# EAGLE design BPW5031 Arcade MegaWing (EAGLE 5.11)
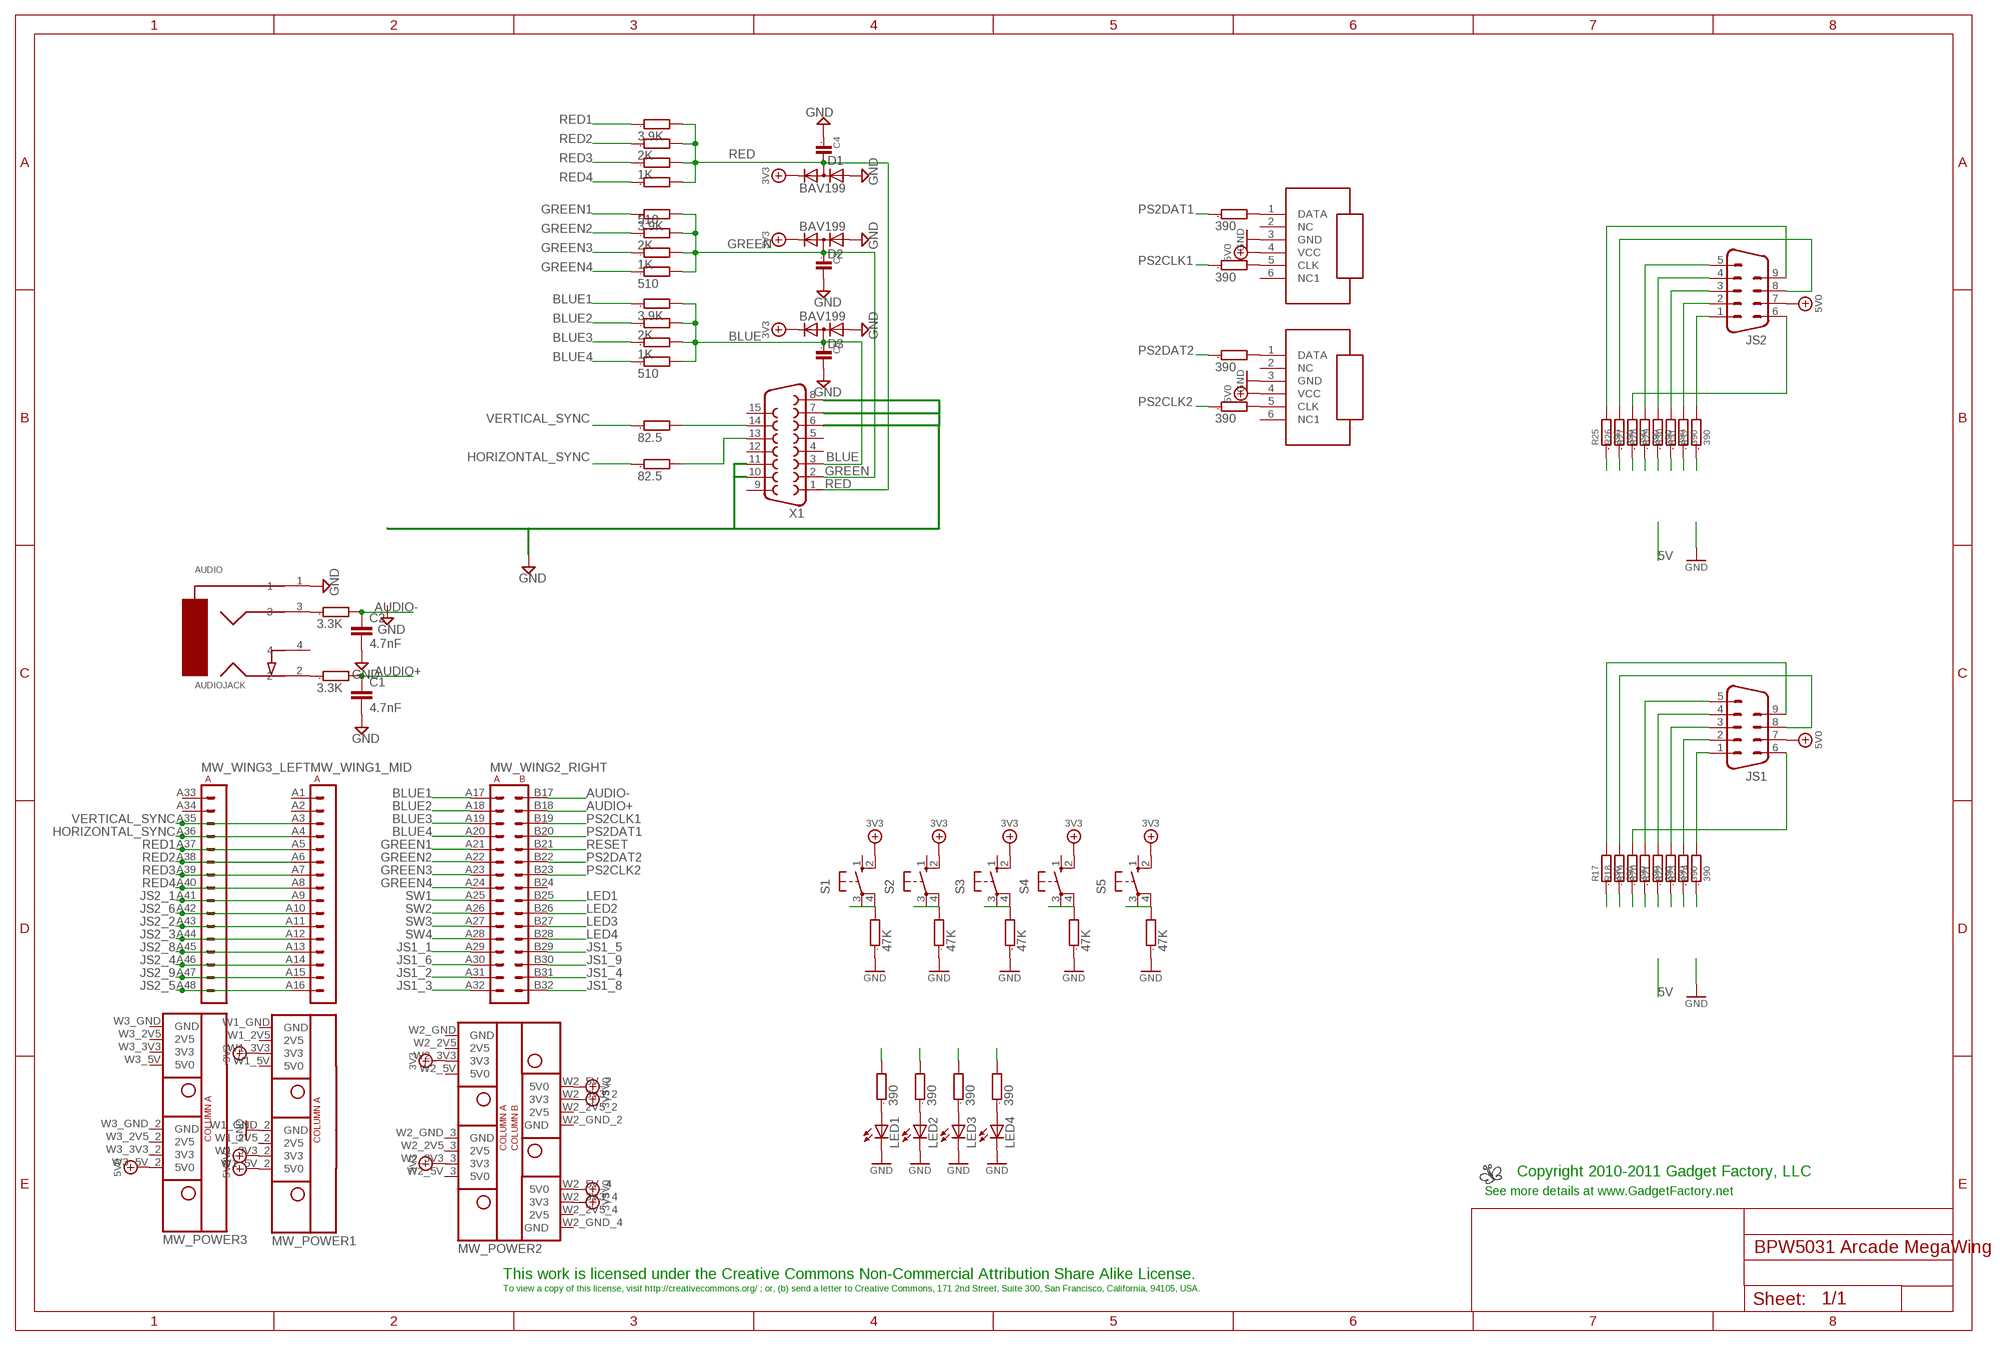
[diagram p0: schematic, sheet 1]

## Parts
AUDIO  AUDIOJACK  [AUDJCK]
C1  4.7nF  C-EU050-025X075  [C050-025X075]
C2  4.7nF  C-EU050-025X075  [C050-025X075]
C3  C0805  [0805]
C4  C0805  [0805]
C5  C0805  [0805]
D1  BAV199  [SOT23]
D2  BAV199  [SOT23]
D3  BAV199  [SOT23]
J2  CON_PS/2  [PS/2]
J3  CON_PS/2  [PS/2]
JS1  M09HP  [M09HP]
JS2  M09HP  [M09HP]
LED1  LEDCHIPLED_0805  [CHIPLED_0805]
LED2  LEDCHIPLED_0805  [CHIPLED_0805]
LED3  LEDCHIPLED_0805  [CHIPLED_0805]
LED4  LEDCHIPLED_0805  [CHIPLED_0805]
LOGO2  BUTTERFLY_LOGO  [BUTTERFLY_LOGO]
MW_  MEGAWING_DUAL_P1  [MEGAWING_FULL_NOHOLES_P1]
R1  3.9K  R0805  [0805]
R2  3.9K  R0805  [0805]
R3  3.9K  R0805  [0805]
R4  82.5  R0805  [0805]
R5  82.5  R0805  [0805]
R6  2K  R0805  [0805]
R7  2K  R0805  [0805]
R8  2K  R0805  [0805]
R9  1K  R0805  [0805]
R10  510  R0805  [0805]
R11  1K  R0805  [0805]
R12  510  R0805  [0805]
R13  1K  R0805  [0805]
R14  510  R0805  [0805]
R15  3.3K  R0805  [0805]
R16  3.3K  R0805  [0805]
R17  390  R0805  [0805]
R18  390  R0805  [0805]
R19  390  R0805  [0805]
R20  390  R0805  [0805]
R21  390  R0805  [0805]
R22  390  R0805  [0805]
R23  390  R0805  [0805]
R24  390  R0805  [0805]
R25  390  R0805  [0805]
R26  390  R0805  [0805]
R27  390  R0805  [0805]
R28  390  R0805  [0805]
R29  390  R0805  [0805]
R30  390  R0805  [0805]
R31  390  R0805  [0805]
R32  390  R0805  [0805]
R33  47K  R0805  [0805]
R34  47K  R0805  [0805]
R35  47K  R0805  [0805]
R36  47K  R0805  [0805]
R37  390  R0805  [0805]
R38  390  R0805  [0805]
R39  390  R0805  [0805]
R40  390  R0805  [0805]
R41  47K  R0805  [0805]
R42  390  R0805  [0805]
R43  390  R0805  [0805]
R44  390  R0805  [0805]
R45  390  R0805  [0805]
S1  10-XX  [B3F-10XX]
S2  10-XX  [B3F-10XX]
S3  10-XX  [B3F-10XX]
S4  10-XX  [B3F-10XX]
S5  10-XX  [B3F-10XX]
X1  F15HDH  [HDF15H]

## Nets
3V3: D1.2(C) D2.2(C) D3.2(C) MW_.W1_3V3(POWER1:3V3) MW_.W1_3V3_2(POWER1:3V3) MW_.W2_3V3(POWER2:3V3) MW_.W2_3V3_2(POWER2:3V3) MW_.W2_3V3_3(POWER2:3V3) MW_.W2_3V3_4(POWER2:3V3) S1.2(S1) S2.2(S1) S3.2(S1) S4.2(S1) S5.2(S1)
5V0: J2.4(VCC) J3.4(VCC) JS1.7 JS2.7 MW_.W1_5V_2(POWER1:5V0) MW_.W2_5V_2(POWER2:5V0) MW_.W2_5V_4(POWER2:5V0) MW_.W3_5V_2(POWER3:5V0)
AUDIO+: C1.1 MW_.B18(WING2_RIGHT:B2) R16.2
AUDIO-: C2.1 MW_.B17(WING2_RIGHT:B1) R15.2
BLUE: C5.1 D3.3(AC) R3.2 R8.2 R13.2 R14.2 X1.3
BLUE1: MW_.A17(WING2_RIGHT:A1) R3.1
BLUE2: MW_.A18(WING2_RIGHT:A2) R8.1
BLUE3: MW_.A19(WING2_RIGHT:A3) R13.1
BLUE4: MW_.A20(WING2_RIGHT:A4) R14.1
GND: AUDIO.1 C1.2 C2.2 C3.2 C4.1 C5.2 D1.1(A) D2.1(A) D3.1(A) J2.3(GND) J3.3(GND) LED1.C LED2.C LED3.C LED4.C MW_.W1_GND_2(POWER1:GND) R33.1 R34.1 R35.1 R36.1 R41.1 X1.6 X1.7 X1.8 X1.10 X1.11
GREEN: C3.1 D2.3(AC) R2.2 R7.2 R11.2 R12.2 X1.2
GREEN1: MW_.A21(WING2_RIGHT:A5) R2.1
GREEN2: MW_.A22(WING2_RIGHT:A6) R7.1
GREEN3: MW_.A23(WING2_RIGHT:A7) R11.1
GREEN4: MW_.A24(WING2_RIGHT:A8) R12.1
HORIZONTAL_SYNC: MW_.A4(WING1_MID:A4) MW_.A36(WING3_LEFT:A4) R4.1
JS1_1: MW_.A29(WING2_RIGHT:A13) R32.1
JS1_2: MW_.A31(WING2_RIGHT:A15) R31.1
JS1_3: MW_.A32(WING2_RIGHT:A16) R30.1
JS1_4: MW_.B31(WING2_RIGHT:B15) R29.1
JS1_5: MW_.B29(WING2_RIGHT:B13) R28.1
JS1_6: MW_.A30(WING2_RIGHT:A14) R27.1
JS1_8: MW_.B32(WING2_RIGHT:B16) R26.1
JS1_9: MW_.B30(WING2_RIGHT:B14) R25.1
JS2_1: MW_.A9(WING1_MID:A9) MW_.A41(WING3_LEFT:A9) R24.1
JS2_2: MW_.A11(WING1_MID:A11) MW_.A43(WING3_LEFT:A11) R23.1
JS2_3: MW_.A12(WING1_MID:A12) MW_.A44(WING3_LEFT:A12) R22.1
JS2_4: MW_.A14(WING1_MID:A14) MW_.A46(WING3_LEFT:A14) R21.1
JS2_5: MW_.A16(WING1_MID:A16) MW_.A48(WING3_LEFT:A16) R20.1
JS2_6: MW_.A10(WING1_MID:A10) MW_.A42(WING3_LEFT:A10) R19.1
JS2_8: MW_.A13(WING1_MID:A13) MW_.A45(WING3_LEFT:A13) R18.1
JS2_9: MW_.A15(WING1_MID:A15) MW_.A47(WING3_LEFT:A15) R17.1
LED1: MW_.B25(WING2_RIGHT:B9) R37.2
LED2: MW_.B26(WING2_RIGHT:B10) R38.2
LED3: MW_.B27(WING2_RIGHT:B11) R39.2
LED4: MW_.B28(WING2_RIGHT:B12) R40.2
N$1: AUDIO.3 R15.1
N$2: AUDIO.2 R16.1
N$3: LED1.A R37.1
N$4: R4.2 X1.13
N$5: R5.2 X1.14
N$9: LED2.A R38.1
N$10: LED3.A R39.1
N$11: LED4.A R40.1
N$12: J2.1(DATA) R42.2
N$13: J2.5(CLK) R43.2
N$14: J3.1(DATA) R44.2
N$15: J3.5(CLK) R45.2
N$16: JS2.1 R32.2
N$17: JS2.2 R31.2
N$18: JS2.3 R30.2
N$19: JS2.4 R29.2
N$20: JS2.5 R28.2
N$21: JS2.9 R25.2
N$22: JS2.6 R27.2
N$23: JS2.8 R26.2
N$32: JS1.1 R24.2
N$33: JS1.2 R23.2
N$34: JS1.3 R22.2
N$35: JS1.4 R21.2
N$36: JS1.5 R20.2
N$37: JS1.9 R17.2
N$38: JS1.6 R19.2
N$39: JS1.8 R18.2
PS2CLK1: MW_.B19(WING2_RIGHT:B3) R43.1
PS2CLK2: MW_.B23(WING2_RIGHT:B7) R45.1
PS2DAT1: MW_.B20(WING2_RIGHT:B4) R42.1
PS2DAT2: MW_.B22(WING2_RIGHT:B6) R44.1
RED: C4.2 D1.3(AC) R1.2 R6.2 R9.2 R10.2 X1.1
RED1: MW_.A5(WING1_MID:A5) MW_.A37(WING3_LEFT:A5) R1.1
RED2: MW_.A6(WING1_MID:A6) MW_.A38(WING3_LEFT:A6) R6.1
RED3: MW_.A7(WING1_MID:A7) MW_.A39(WING3_LEFT:A7) R9.1
RED4: MW_.A8(WING1_MID:A8) MW_.A40(WING3_LEFT:A8) R10.1
RESET: MW_.B21(WING2_RIGHT:B5) R41.2 S5.3(P) S5.4(P1)
SW1: MW_.A25(WING2_RIGHT:A9) R33.2 S1.3(P) S1.4(P1)
SW2: MW_.A26(WING2_RIGHT:A10) R34.2 S2.3(P) S2.4(P1)
SW3: MW_.A27(WING2_RIGHT:A11) R35.2 S3.3(P) S3.4(P1)
SW4: MW_.A28(WING2_RIGHT:A12) R36.2 S4.3(P) S4.4(P1)
VERTICAL_SYNC: MW_.A3(WING1_MID:A3) MW_.A35(WING3_LEFT:A3) R5.1
Unconnected: AUDIO.4 J2.2(NC) J2.6(NC1) J3.2(NC) J3.6(NC1) MW_.A1(WING1_MID:A1) MW_.A2(WING1_MID:A2) MW_.A33(WING3_LEFT:A1) MW_.A34(WING3_LEFT:A2) MW_.B24(WING2_RIGHT:B8) MW_.W1_2V5(POWER1:2V5) MW_.W1_2V5_2(POWER1:2V5) MW_.W1_5V(POWER1:5V0) MW_.W2_2V5(POWER2:2V5) MW_.W2_2V5_2(POWER2:2V5) MW_.W2_2V5_3(POWER2:2V5) MW_.W2_2V5_4(POWER2:2V5) MW_.W2_5V(POWER2:5V0) MW_.W2_5V_3(POWER2:5V0) MW_.W3_2V5(POWER3:2V5) MW_.W3_2V5_2(POWER3:2V5) MW_.W3_3V3(POWER3:3V3) MW_.W3_3V3_2(POWER3:3V3) MW_.W3_5V(POWER3:5V0) S1.1(S) S2.1(S) S3.1(S) S4.1(S) S5.1(S) X1.4 X1.5 X1.9 X1.12 X1.15

## Notes on the sheet
- Copyright 2010-2011 Gadget Factory, LLC
- See more details at www.GadgetFactory.net
- This work is licensed under the Creative Commons Non-Commercial Attribution Share Alike License.
- To view a copy of this license, visit http://creativecommons.org/ ; or, (b) send a letter to Creative Commons, 171 2nd Street, Suite 300, San Francisco, California, 94105, USA.

## Power pins joined to a net without a drawn wire
GND: MW_.W1_GND(POWER1:GND) MW_.W2_GND(POWER2:GND) MW_.W2_GND_2(POWER2:GND) MW_.W2_GND_3(POWER2:GND) MW_.W2_GND_4(POWER2:GND) MW_.W3_GND(POWER3:GND) MW_.W3_GND_2(POWER3:GND)

## Library data of the parts
AUDIO = GadgetFactory:AUDIOJACK
C1 C2 = resistor:C-EU: CAPACITOR, European symbol
C3-C5 = GadgetFactory:C: CAPACITOR, European symbol
D1-D3 = diode:BAV199: DIODE low-leakage double diode
J2 J3 = usb1:CON_PS/2
JS1 JS2 = con-subd:M09: SUB-D
LED1-LED4 = led:LED: LED OSRAM: - CHIPLED LG R971, LG N971, LY N971, LG Q971, LY Q971, LO R971, LY R971 LH N974, LH R974 LS Q976, LO Q976, LY Q976 LO Q996 - Hyper CHIPLED LW Q18S LB Q993, LB Q99A, LB R99A - SideLED LS A670, LO A670, LY A670, LG A670, LP A670 LB A673, LV A673, LT A673, LW A673 LH A674 LY A675 LS A676, LA A676, LO A676, LY A676, LW A676 LS A679, LY A679, LG A679 - Hyper Micro SIDELED® LS Y876, LA Y876, LO Y876, LY Y876 LT Y87S - SmartLED LW L88C, LW L88S LB L89C, LB L89S, LG L890 LS L89K, LO L89K, LY L89K LS L896, LA L896, LO L896, LY L896 - TOPLED LS T670, LO T670, LY T670, LG T670, LP T670 LSG T670, LSP T670, LSY T670, LOP T670, LYG T670 LG T671, LOG T671, LSG T671 LB T673, LV T673, LT T673, LW T673 LH T674 LS T676, LA T676, LO T676, LY T676, LB T676, LH T676, LSB T676, LW T676 LB T67C, LV T67C, LT T67C, LS T67K, LO T67K, LY T67K, LW E67C LS E67B, LA E67B, LO E67B, LY E67B, LB E67C, LV E67C, LT E67C LW T67C LS T679, LY T679, LG T679 LS T770, LO T770, LY T770, LG T770, LP T770 LB T773, LV T773, LT T773, LW T773 LH T774 LS E675, LA E675, LY E675, LS T675 LS T776, LA T776, LO T776, LY T776, LB T776 LHGB T686 LT T68C, LB T68C - Hyper Mini TOPLED® LB M676 - Mini TOPLED Santana® LG M470 LS M47K, LO M47K, LY M47K Source: http://www.osram.convergy.de LUXEON: - LUMILED® LXK2-PW12-R00, LXK2-PW12-S00, LXK2-PW14-U00, LXK2-PW14-V00 LXK2-PM12-R00, LXK2-PM12-S00, LXK2-PM14-U00 LXK2-PE12-Q00, LXK2-PE12-R00, LXK2-PE12-S00, LXK2-PE14-T00, LXK2-PE14-U00 LXK2-PB12-K00, LXK2-PB12-L00, LXK2-PB12-M00, LXK2-PB14-N00, LXK2-PB14-P00, LXK2-PB14-Q00 LXK2-PR12-L00, LXK2-PR12-M00, LXK2-PR14-Q00, LXK2-PR14-R00 LXK2-PD12-Q00, LXK2-PD12-R00, LXK2-PD12-S00 LXK2-PH12-R00, LXK2-PH12-S00 LXK2-PL12-P00, LXK2-PL12-Q00, LXK2-PL12-R00 Source: www.luxeon.com KINGBRIGHT: KA-3528ASYC Source: www.kingbright.com
LOGO2 = GadgetFactory_Pub:BUTTERFLY_LOGO
MW_ = Papilio:MEGAWING_DUAL_P1
R1-R45 = GadgetFactory:R: RESISTOR, European symbol
S1-S5 = opto:10-XX: OMRON SWITCH
X1 = con-subd:F15: SUB-D

## Board
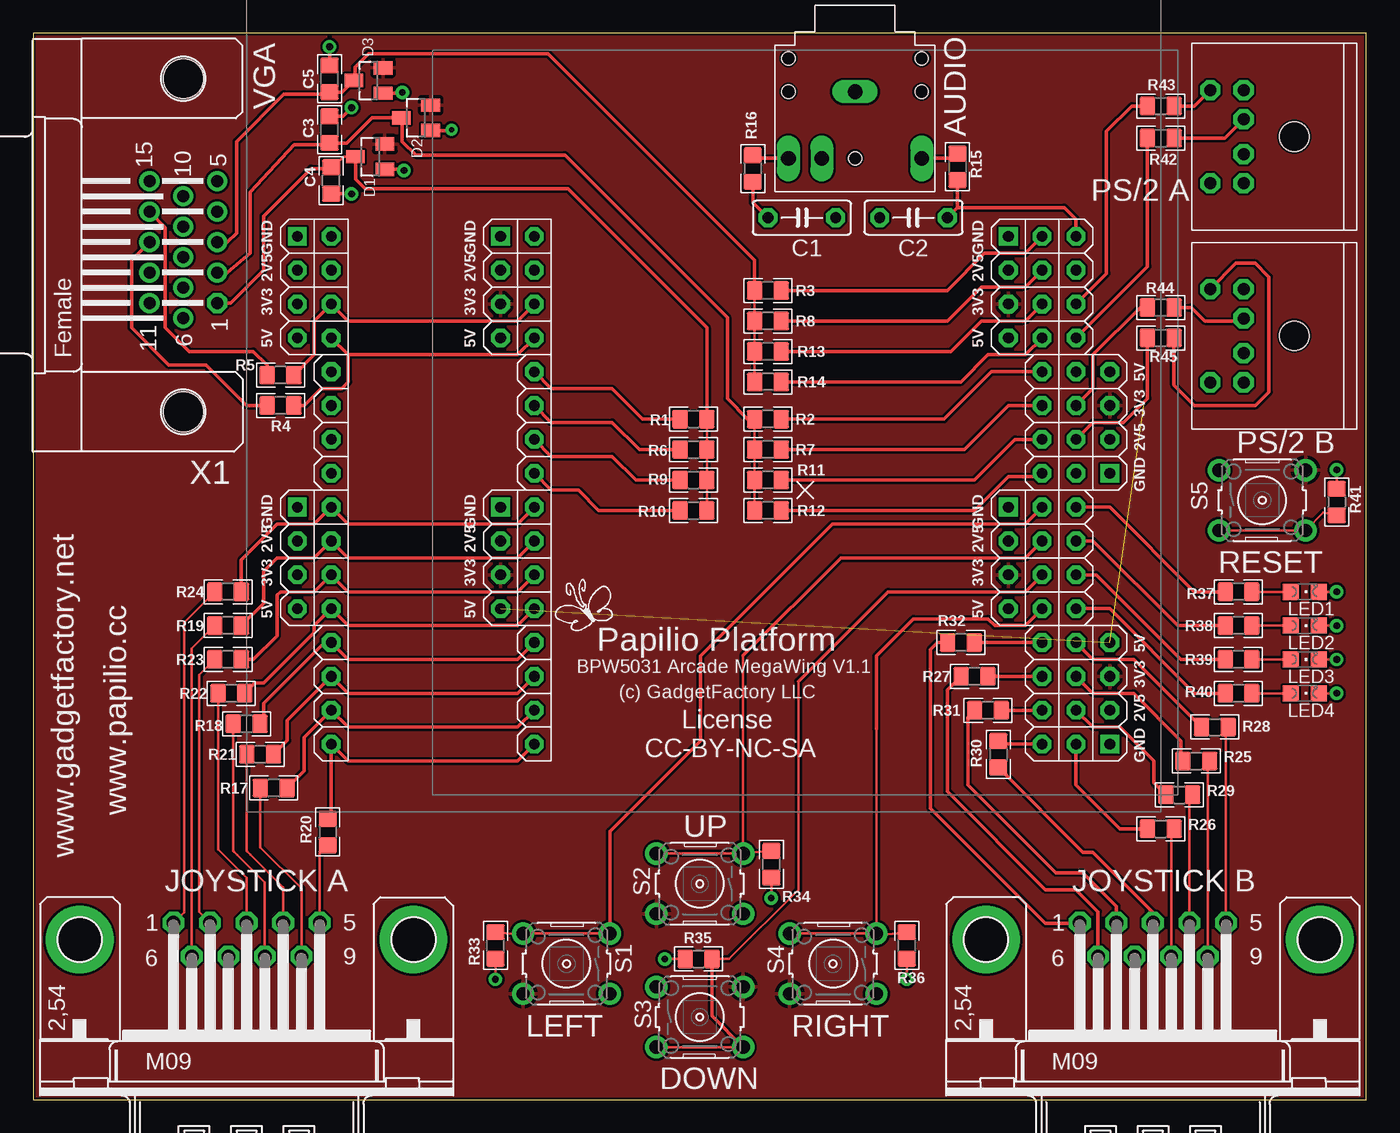
[diagram p1: board, top side]
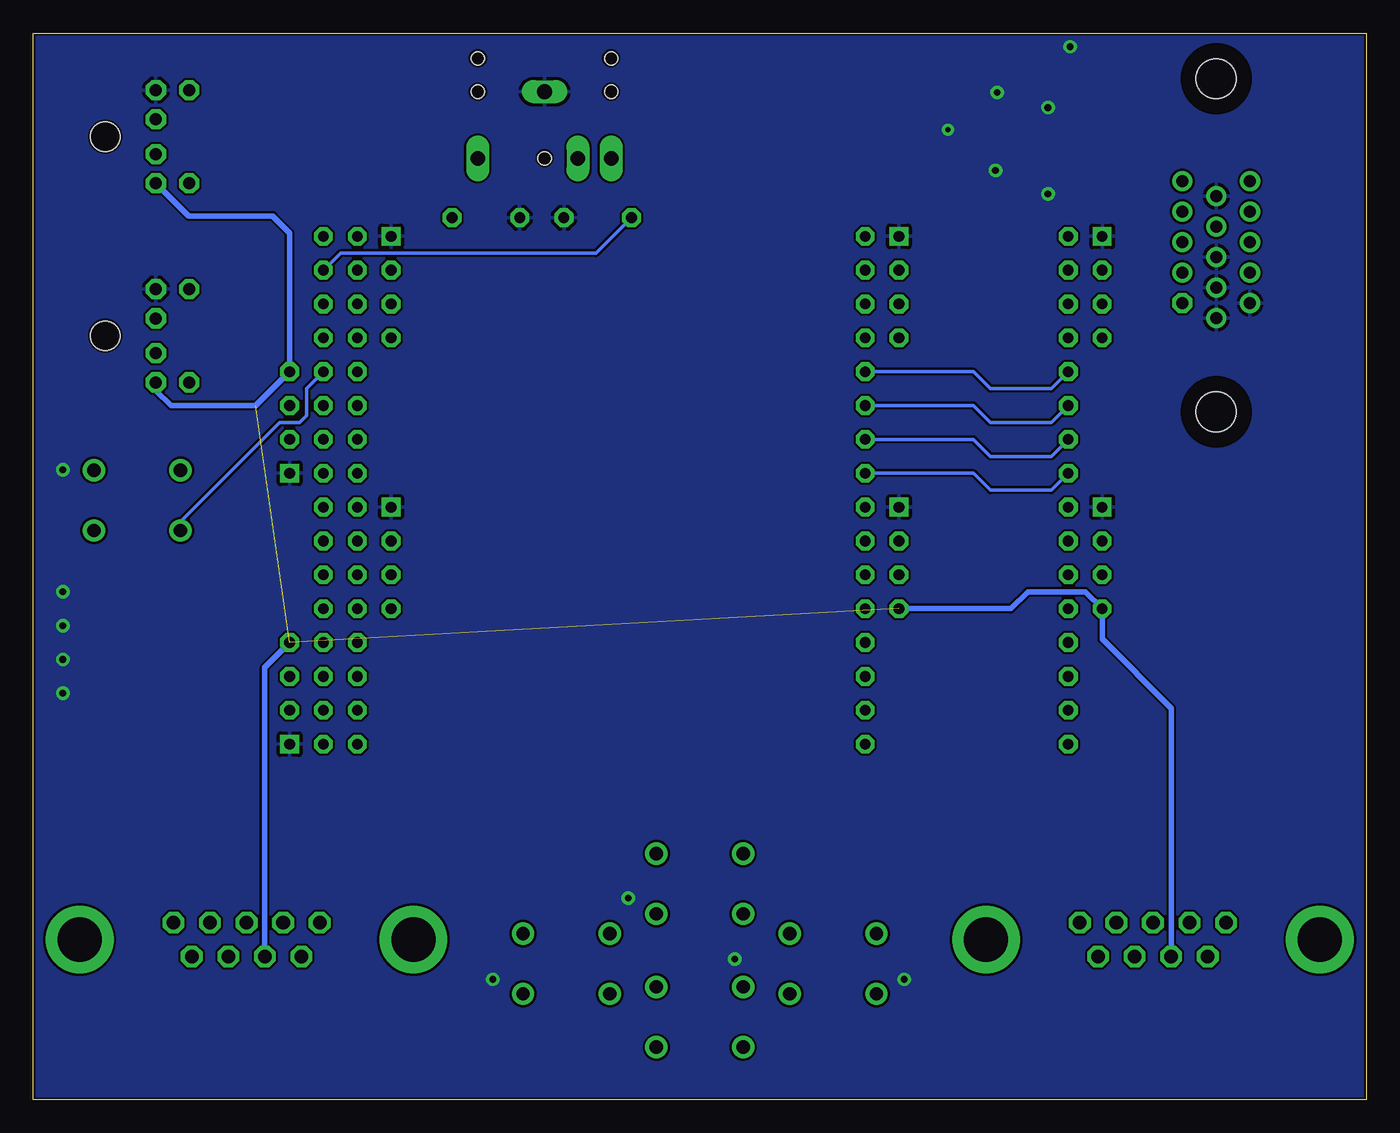
[diagram p2: board, bottom side, seen from below]

Size 100 x 80 mm. Coordinates in mm from the lower left corner, seen from the top.
Outline: 0,0 100,0 100,80 0,80 0,0
Copper layers (1*16): Top 0.035mm / dielectric 1.5mm / Bottom 0.035mm
Design rules "SparkFun_Derived_GoldePheonix_7mil *": minimum track width 7mil, minimum drill 15mil, track to track 7mil, track to pad 7mil, pad to pad 7mil, via to via 7mil, smd to smd 7mil, copper to edge 7mil, drill to drill 7mil, minimum pad ring 12mil, minimum via ring 10mil, stop-mask expansion 4mil, vias tented up to drill 18mil, thermal gap 10mil

### Footprints (pad centres in the part's own frame; a part is rotated, then mirrored left to right if it is on the bottom)
AUDJCK = drill 1.1 long: 1 -5,0; 2 -10,5; 3 -10,-5; 4 -10,2.5 | hole 1: -5,5; -5,-5; -2.5,5; -2.5,-5; -10,0
C050-025X075 = drill 0.813 octagon: 1 -2.54,0; 2 2.54,0
0805 = smd 1.2 x 1.4: 1 -1,0; 2 1,0
SOT23 = smd 1 x 1.4: 1 -0.95,-1.1; 2 0.95,-1.1; 3 0,1.1
PS/2 = drill 0.9 octagon: 1 -1.27,0; 2 1.33,0; 3 -3.47,0; 4 3.53,0; 5 -3.47,-2.5; 6 3.53,-2.5 | hole 2.2: 0.03,3.8
M09HP = drill 1.016 octagon: 1 -5.486,1.27; 2 -2.743,1.27; 3 0,1.27; 4 2.743,1.27; 5 5.486,1.27; 6 -4.115,-1.27; 7 -1.372,-1.27; 8 1.372,-1.27; 9 4.115,-1.27 | drill 3.302 pad 5.08 round: G1 -12.522,0; G2 12.522,0
CHIPLED_0805 = smd 1.2 x 1.2: A 0,-1.05; C 0,1.05
MEGAWING_FULL_NOHOLES_P1 = drill 0.8 octagon: A1 -20.32,19.05; A2 -20.32,16.51; A3 -20.32,13.97; A4 -20.32,11.43; A5 -20.32,8.89; A6 -20.32,6.35; A7 -20.32,3.81; A8 -20.32,1.27; A9 -20.32,-1.27; A10 -20.32,-3.81; A11 -20.32,-6.35; A12 -20.32,-8.89; A13 -20.32,-11.43; A14 -20.32,-13.97; A15 -20.32,-16.51; A16 -20.32,-19.05; A17 17.78,19.05; A18 17.78,16.51; A19 17.78,13.97; A20 17.78,11.43; A21 17.78,8.89; A22 17.78,6.35; A23 17.78,3.81; A24 17.78,1.27; A25 17.78,-1.27; A26 17.78,-3.81; A27 17.78,-6.35; A28 17.78,-8.89; A29 17.78,-11.43; A30 17.78,-13.97; A31 17.78,-16.51; A32 17.78,-19.05; A33 -35.56,19.05; A34 -35.56,16.51; A35 -35.56,13.97; A36 -35.56,11.43; A37 -35.56,8.89; A38 -35.56,6.35; A39 -35.56,3.81; A40 -35.56,1.27; A41 -35.56,-1.27; A42 -35.56,-3.81; A43 -35.56,-6.35; A44 -35.56,-8.89; A45 -35.56,-11.43; A46 -35.56,-13.97; A47 -35.56,-16.51; A48 -35.56,-19.05; B17 20.32,19.05; B18 20.32,16.51; B19 20.32,13.97; B20 20.32,11.43; B21 20.32,8.89; B22 20.32,6.35; B23 20.32,3.81; B24 20.32,1.27; B25 20.32,-1.27; B26 20.32,-3.81; B27 20.32,-6.35; B28 20.32,-8.89; B29 20.32,-11.43; B30 20.32,-13.97; B31 20.32,-16.51; B32 20.32,-19.05; W1_2V5 -22.86,16.51; W1_2V5_2 -22.86,-3.81; W1_3V3 -22.86,13.97; W1_3V3_2 -22.86,-6.35; W1_5V -22.86,11.43; W1_5V_2 -22.86,-8.89; W2_2V5 15.24,16.51; W2_2V5_2 22.86,3.81; W2_2V5_3 15.24,-3.81; W2_2V5_4 22.86,-16.51; W2_3V3 15.24,13.97; W2_3V3_2 22.86,6.35; W2_3V3_3 15.24,-6.35; W2_3V3_4 22.86,-13.97; W2_5V 15.24,11.43; W2_5V_2 22.86,8.89; W2_5V_3 15.24,-8.89; W2_5V_4 22.86,-11.43; W3_2V5 -38.1,16.51; W3_2V5_2 -38.1,-3.81; W3_3V3 -38.1,13.97; W3_3V3_2 -38.1,-6.35; W3_5V -38.1,11.43; W3_5V_2 -38.1,-8.89 | drill 0.8 square: W1_GND -22.86,19.05; W1_GND_2 -22.86,-1.27; W2_GND 15.24,19.05; W2_GND_2 22.86,1.27; W2_GND_3 15.24,-1.27; W2_GND_4 22.86,-19.05; W3_GND -38.1,19.05; W3_GND_2 -38.1,-1.27
B3F-10XX = drill 1 pad 1.676 round: 1 -3.251,2.261; 2 3.251,2.261; 3 -3.251,-2.261; 4 3.251,-2.261
HDF15H = drill 0.9 octagon: 1 4.329,2.54 | drill 0.9 round: 2 2.043,2.54; 3 -0.243,2.54; 4 -2.529,2.54; 5 -4.815,2.54; 6 5.472,0; 7 3.186,0; 8 0.9,0; 9 -1.386,0; 10 -3.672,0; 11 4.329,-2.54; 12 2.043,-2.54; 13 -0.243,-2.54; 14 -2.529,-2.54; 15 -4.815,-2.54 | hole 3: -12.5,0; 12.5,0

### Placement (x,y rotation side)
AUDIO  61.65,80.62 90 top
C1  57.66,66.17 0 top
C2  66.04,66.17 180 top
C3  22.23,72.77 90 top
C4  22.35,68.96 90 top
C5  22.23,76.58 90 top
D1  25.27,70.74 90 top
D2  28.7,73.66 90 top
D3  25.15,76.45 90 top
J2  90.8,72.27 270 top
J3  90.8,57.34 270 top
JS1  16,12 0 top
JS2  84,12 0 top
LED1  95.38,38.1 270 top
LED2  95.38,35.56 270 top
LED3  95.38,33.02 270 top
LED4  95.38,30.48 270 top
LOGO2  41.4,36.58 0 top
MW_  57.91,45.72 0 top
R1  49.53,51.05 0 top
R2  55.12,51.05 180 top
R3  55.12,60.71 180 top
R4  18.54,52.07 180 top
R5  18.54,54.36 180 top
R6  49.53,48.77 0 top
R7  55.12,48.77 180 top
R8  55.12,58.42 180 top
R9  49.53,46.48 0 top
R10  49.53,44.2 0 top
R11  55.12,46.48 180 top
R12  55.12,44.2 180 top
R13  55.12,56.13 180 top
R14  55.12,53.85 180 top
R15  69.34,69.98 270 top
R16  53.98,69.85 270 top
R17  18.03,23.37 180 top
R18  16,28.19 180 top
R19  14.61,35.56 180 top
R20  22.1,20.07 270 top
R21  17.02,25.91 180 top
R22  14.86,30.48 180 top
R23  14.61,33.02 180 top
R24  14.61,38.1 180 top
R25  87.25,25.4 0 top
R26  84.58,20.32 0 top
R27  70.61,31.75 180 top
R28  88.65,27.94 0 top
R29  85.98,22.86 0 top
R30  72.39,25.91 270 top
R31  71.63,29.21 180 top
R32  69.6,34.29 180 top
R33  34.67,11.56 90 top
R34  55.37,17.65 90 top
R35  49.91,10.54 0 top
R36  65.53,11.56 90 top
R37  90.42,38.1 180 top
R38  90.42,35.56 180 top
R39  90.42,33.02 180 top
R40  90.42,30.48 180 top
R41  97.79,44.83 270 top
R42  84.58,72.14 0 top
R43  84.58,74.55 0 top
R44  84.58,59.44 0 top
R45  84.58,57.15 0 top
S1  40,10.19 180 top
S2  50,16.19 180 top
S3  50,6.19 0 top
S4  60,10.19 180 top
S5  92.2,44.96 0 top
X1  11.26,64.1 270 top

### Tracks (layer width: path | path; a pad name or v marks a point on that pad's centre or on a via)
3V3
  pour Top: 0,-0.13 99.95,-0.13 99.95,80.01 0,80.01
5V0  (2 unrouted)
  Bottom 0.406: JS2.7 82.63,32.43 MW_.W2_5V_4 | JS1.7 14.63,29.36 19.81,34.54 MW_.W3_5V_2 21.08,38.1 25.4,38.1 26.67,36.83 MW_.W1_5V_2 | J3.4 90.8,53.21 89.66,52.07 83.31,52.07 MW_.W2_5V_2 80.77,65.02 82.04,66.29 88.35,66.29 J2.4
AUDIO+
  Top 0.254: R16.2 53.98,67.31 C1.1
  Bottom 0.254: MW_.B18 76.96,63.5 57.78,63.5 C1.1
AUDIO-
  Top 0.254: 69.34,66.93 R15.2 | C2.1 69.34,66.93 | 69.34,66.93 77.34,66.93 78.23,66.04 MW_.B17
BLUE
  Top 0.203: R3.2 R8.2 R13.2 R14.2
  Top 0.254: X1.3 14.56,64.34 15.24,65.02 15.24,71.88 18.8,75.44 22.08,75.44 C5.1 23.17,75.58 D3.3 24.13,76.54 24.13,77.47 25.15,78.49 38.61,78.49 54.12,62.98 R3.2
BLUE1
  Top 0.254: R3.1 68.58,60.71 71.37,63.5 74.42,63.5 MW_.A17
BLUE2
  Top 0.254: R8.1 68.58,58.42 71.12,60.96 74.42,60.96 MW_.A18
BLUE3
  Top 0.254: R13.1 68.83,56.13 71.12,58.42 74.42,58.42 MW_.A19
BLUE4
  Top 0.254: R14.1 69.6,53.85 71.63,55.88 74.42,55.88 MW_.A20
GND  (via drill 0.38, 0.5)
  Top 0.203: v65.53,9.02 R36.1 | v47.37,10.54 R35.1 | v34.67,9.02 R33.1 | v55.37,15.11 R34.1 | LED4.C v97.79,30.48 | LED3.C v97.79,33.02 | LED2.C v97.79,35.56 | LED1.C v97.79,38.1 | R41.1 v97.79,47.24
  Top 0.254: C5.2 v22.23,78.99 | D3.1 27.62,75.5 v27.69,75.56 | D1.1 27.75,69.79 v27.81,69.72 | D2.1 31.31,72.71 v31.37,72.77 | C3.2 23.23,73.77 v23.88,74.42 | C4.1 23.86,67.96 v23.88,67.94
  Bottom 0.254: v31.37,72.77 31.37,73.03
  pour Bottom: 0,-0.13 99.95,-0.13 99.95,80.01 0,80.01
GREEN
  Top 0.203: R2.2 R7.2 R11.2 R12.2
  Top 0.254: X1.2 14.56,62.05 16.26,63.5 16.26,68.07 19.56,71.63 22.08,71.63 C3.1 23.51,71.77 25.4,73.66 D2.3 27.69,73.58 27.69,71.88 28.7,70.87 39.88,70.87 52.07,58.67 52.07,52.58 53.59,51.05 R2.2
GREEN1
  Top 0.254: R2.1 68.33,51.05 71.88,54.61 MW_.A21
GREEN2
  Top 0.254: R7.1 69.85,48.77 73.15,52.07 MW_.A22
GREEN3
  Top 0.254: R11.1 70.61,46.48 73.66,49.53 MW_.A23
GREEN4
  Top 0.254: R12.1 70.61,44.2 73.15,46.74 75.44,46.74 MW_.A24
HORIZONTAL_SYNC
  Top 0.254: R4.1 20.32,52.07 21.59,53.34 23.11,53.34 23.62,53.85 23.62,55.88 | 23.62,55.88 MW_.A36 | 23.62,55.88 36.32,55.88 MW_.A4
JS1_1
  Top 0.254: R32.1 MW_.A29
JS1_2
  Top 0.254: R31.1 MW_.A31
JS1_3
  Top 0.203: R30.1 72.43,26.67
  Top 0.254: MW_.A32 72.63,26.67 R30.1
JS1_4
  Top 0.254: MW_.B31 79.5,27.94 81.53,27.94 84.07,25.4 84.07,23.77 R29.1
JS1_5
  Top 0.254: MW_.B29 79.5,33.02 82.57,33.02 R28.1
JS1_6
  Top 0.254: R27.1 MW_.A30
JS1_8
  Top 0.254: MW_.B32 78.23,23.62 81.53,20.32 R26.1
JS1_9
  Top 0.254: MW_.B30 79.5,30.48 82.55,30.48 86.11,26.92 86.11,25.54 R25.1
JS2_1
  Top 0.254: R24.1 15.61,40.5 18.29,43.18 21.08,43.18 MW_.A41 23.62,43.18 36.32,43.18 MW_.A9
JS2_2
  Top 0.254: R23.1 16.51,33.02 18.29,34.8 18.29,37.85 18.54,38.1 21.08,38.1 MW_.A43 23.62,38.1 36.32,38.1 MW_.A11
JS2_3
  Top 0.254: R22.1 16.62,31.24 17.27,31.24 21.08,35.05 21.08,35.56 MW_.A44 23.62,35.56 36.32,35.56 MW_.A12
JS2_4
  Top 0.254: R21.1 19.05,26.94 19.05,28.45 MW_.A46 23.62,30.48 36.32,30.48 MW_.A14
JS2_5
  Top 0.254: R20.1 22.35,21.32 MW_.A48 23.62,25.4 36.32,25.4 MW_.A16
JS2_6
  Top 0.254: R19.1 17.27,37.23 17.27,39.62 18.29,40.64 21.08,40.64 MW_.A42 23.62,40.64 36.32,40.64 MW_.A10
JS2_8
  Top 0.254: R18.1 17.27,28.46 17.27,29.72 21.84,34.29 MW_.A45 23.62,33.02 36.32,33.02 MW_.A13
JS2_9
  Top 0.254: R17.1 20.32,24.65 20.32,27.18 MW_.A47 23.62,27.94 36.32,27.94 MW_.A15
LED1
  Top 0.254: MW_.B25 80.77,44.45 87.12,38.1 R37.2
LED2
  Top 0.254: MW_.B26 79.5,41.91 85.85,35.56 R38.2
LED3
  Top 0.254: MW_.B27 79.76,39.37 86.11,33.02 R39.2
LED4
  Top 0.254: MW_.B28 80.77,36.83 87.12,30.48 R40.2
N$1
  Top 0.254: AUDIO.3 68.98,70.62 R15.1
N$2
  Top 0.254: AUDIO.2 54.21,70.62 R16.1
N$3
  Top 0.203: R37.1 LED1.A
N$4
  Top 0.254: R4.2 16,52.07 12.95,55.12 10.16,55.12 7.37,57.91 7.37,62.99 X1.13
N$5
  Top 0.254: R5.2 17.54,55.1 16.51,56.13 11.68,56.13 9.91,57.91 9.91,65.44 X1.14
N$9
  Top 0.203: R38.1 LED2.A
N$10
  Top 0.203: R39.1 LED3.A
N$11
  Top 0.203: R40.1 LED4.A
N$12
  Top 0.254: R42.2 89.4,72.14 J2.1
N$13
  Top 0.254: R43.2 87.11,74.55 J2.5
N$14
  Top 0.254: R44.2 86.87,59.44 87.88,58.42 90.61,58.42 J3.1
N$15
  Top 0.254: R45.2 85.58,53.61 87.12,52.07 91.69,52.07 92.71,53.09 92.71,61.72 91.69,62.74 90.23,62.74 J3.5
N$16
  Top 0.254: R32.2 67.82,34.29 67.31,33.78 67.31,21.84 75.95,13.21 78.45,13.21 JS2.1
N$17
  Top 0.254: JS2.2 81.26,14.5 78.74,17.02 76.71,17.02 70.1,23.62 70.1,28.69 R31.2
N$18
  Top 0.254: JS2.3 84,14.04 79.5,18.54 78.76,18.54 R30.2
N$19
  Top 0.203: JS2.4 86.74,22.82 R29.2
N$20
  Top 0.203: JS2.5 89.49,27.9 R28.2
N$21
  Top 0.203: JS2.9 88.11,25.33 R25.2
N$22
  Top 0.254: JS2.6 79.89,14.1 78.23,15.75 75.95,15.75 68.58,23.11 68.58,30.72 R27.2
N$23
  Top 0.203: JS2.8 85.37,20.31 R26.2
N$32
  Top 0.203: JS1.1 11.3,14.06 11.3,35.8 R24.2
N$33
  Top 0.203: JS1.2 12.45,14.08 12.45,31.86 R23.2
N$34
  Top 0.203: JS1.3 16,16.64 13.86,18.78 R22.2
N$35
  Top 0.203: JS1.4 18.74,15.93 16.32,18.35 16.09,18.58 16.02,18.65 R21.2
N$36
  Top 0.203: JS1.5 21.49,18.45 R20.2
N$37
  Top 0.203: JS1.9 20.11,15.83 17.03,18.91 R17.2
N$38
  Top 0.203: JS1.6 11.88,33.84 R19.2
N$39
  Top 0.203: JS1.8 17.37,16.28 15.3,18.35 15.07,18.58 15,18.65 R18.2
PS2CLK1
  Top 0.254: R43.1 82.42,74.55 80.52,72.64 80.52,61.98 MW_.B19
PS2CLK2
  Top 0.254: R45.1 83.58,52.59 81.79,50.8 79.5,50.8 MW_.B23
PS2DAT1
  Top 0.254: R42.1 83.58,62.5 MW_.B20
PS2DAT2
  Top 0.254: R44.1 83.06,59.44 79.5,55.88 79.5,53.34 MW_.B22
RED
  Top 0.203: 22.27,69.67 C4.2 23.33,70.74 D1.3 | R1.2 R6.2 R9.2 R10.2
  Top 0.254: X1.1 14.81,59.77 17.27,62.23 17.27,66.29 20.83,69.85 22.24,69.85 C4.2 | D1.3 24.17,69.05 24.89,68.33 40.13,68.33 50.53,57.93 R1.2
RED1
  Top 0.254: R1.1 45.72,51.05 43.43,53.34 38.86,53.34 MW_.A5
  Bottom 0.254: MW_.A5 29.46,54.61 28.19,53.34 23.62,53.34 MW_.A37
RED2
  Top 0.254: R6.1 45.47,48.77 43.43,50.8 38.86,50.8 MW_.A6
  Bottom 0.254: MW_.A6 29.46,52.07 28.19,50.8 23.62,50.8 MW_.A38
RED3
  Top 0.254: R9.1 45.21,46.48 43.43,48.26 38.86,48.26 MW_.A7
  Bottom 0.254: MW_.A7 29.46,49.53 28.19,48.26 23.62,48.26 MW_.A39
RED4
  Top 0.254: R10.1 42.42,44.2 40.89,45.72 38.86,45.72 MW_.A8
  Bottom 0.254: MW_.A8 29.46,46.99 28.19,45.72 23.62,45.72 MW_.A40
RESET
  Top 0.203: R41.2 96.79,44.03 S5.4 S5.3
  Bottom 0.254: S5.3 88.95,43.38 81.53,50.8 80.01,50.8 79.5,51.31 79.5,53.34 MW_.B21
SW1
  Top 0.203: R33.2 36.66,12.36 S1.4 S1.3
  Top 0.254: S1.3 43.25,20.14 50.04,26.92 50.04,33.27 59.94,43.18 74.42,43.18 MW_.A25
SW2
  Top 0.203: R34.2 S2.3 | S2.3 53.25,33.31 | S2.4 S2.3
  Top 0.254: MW_.A26 74.42,40.64 60.58,40.64 53.25,33.31
SW3
  Top 0.203: R35.2 52.2,10.54 57.4,15.75 57.4,31.37 | S3.3 S3.4
  Top 0.254: MW_.A27 74.42,38.1 64.14,38.1 57.4,31.37 | R35.2 50.91,6.27 S3.4
SW4
  Top 0.203: 63.75,12.36 63.34,12.36 S4.3 63.25,27.82 | 63.75,12.36 R36.2 | S4.4 63.66,12.45 63.75,12.36
  Top 0.254: MW_.A28 74.42,35.56 72.14,35.56 71.63,36.07 66.04,36.07 63.25,33.27 63.25,27.82
VERTICAL_SYNC
  Top 0.254: R5.1 19.56,54.36 21.08,55.88 21.08,58.42 MW_.A35 23.62,58.42 36.32,58.42 MW_.A3

### Text on the board
tPlace: VGA | AUDIO | PS/2 A | PS/2 B | RESET | Papilio Platform | BPW5031 Arcade MegaWing V1.1 | (c) GadgetFactory LLC | License | CC-BY-NC-SA | www.papilio.cc | UP | www.gadgetfactory.net | JOYSTICK A | JOYSTICK B | LEFT | RIGHT | DOWN